# Altium schematic sheet 0250.SchDoc
size 848 x 558 mm
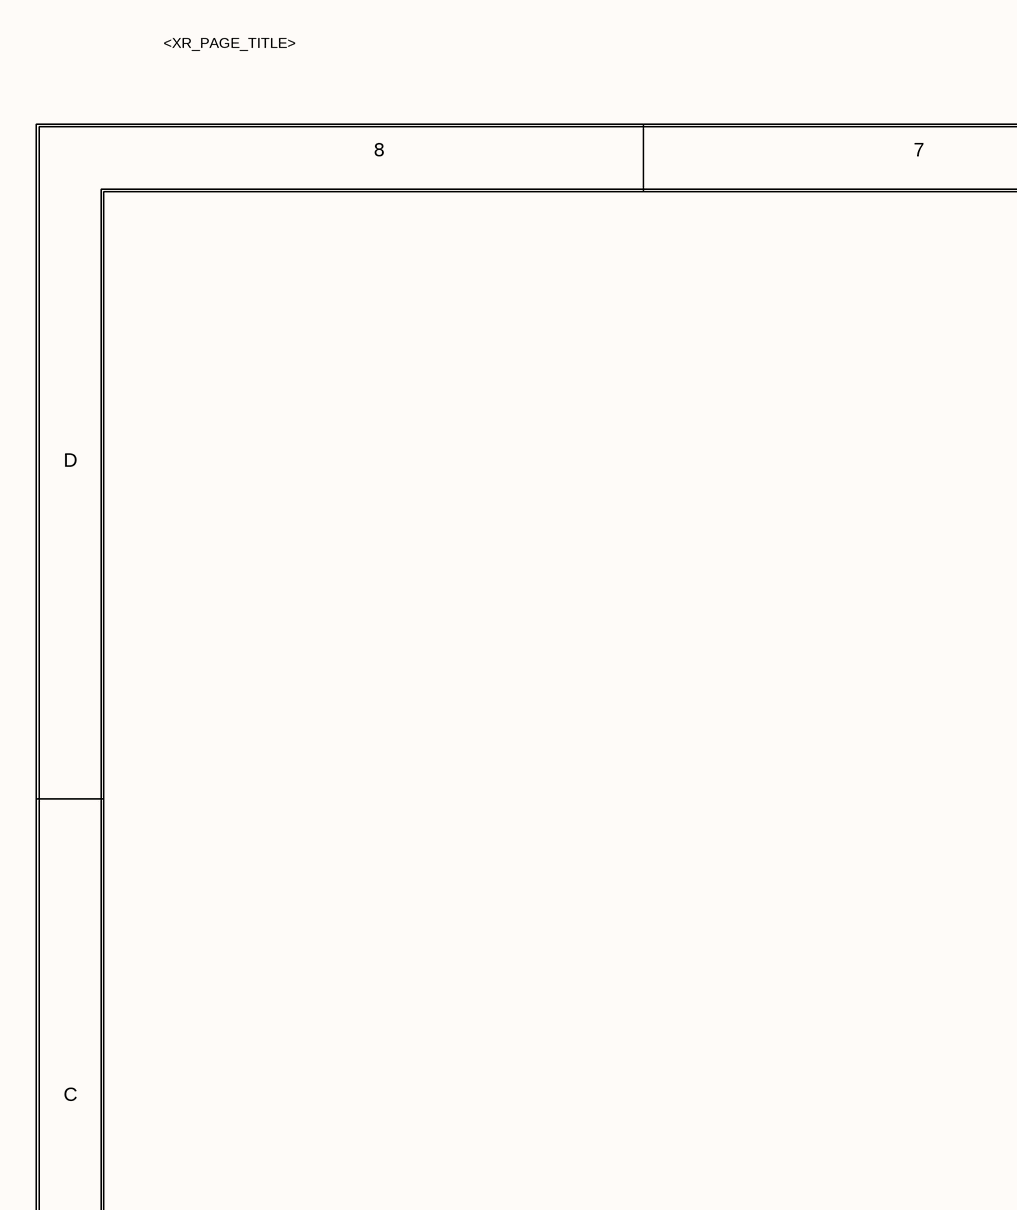
[diagram p0: 0250.SchDoc, top left]
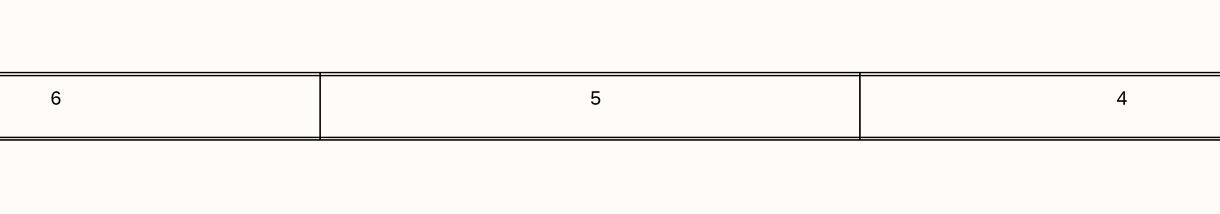
[diagram p1: 0250.SchDoc, top middle]
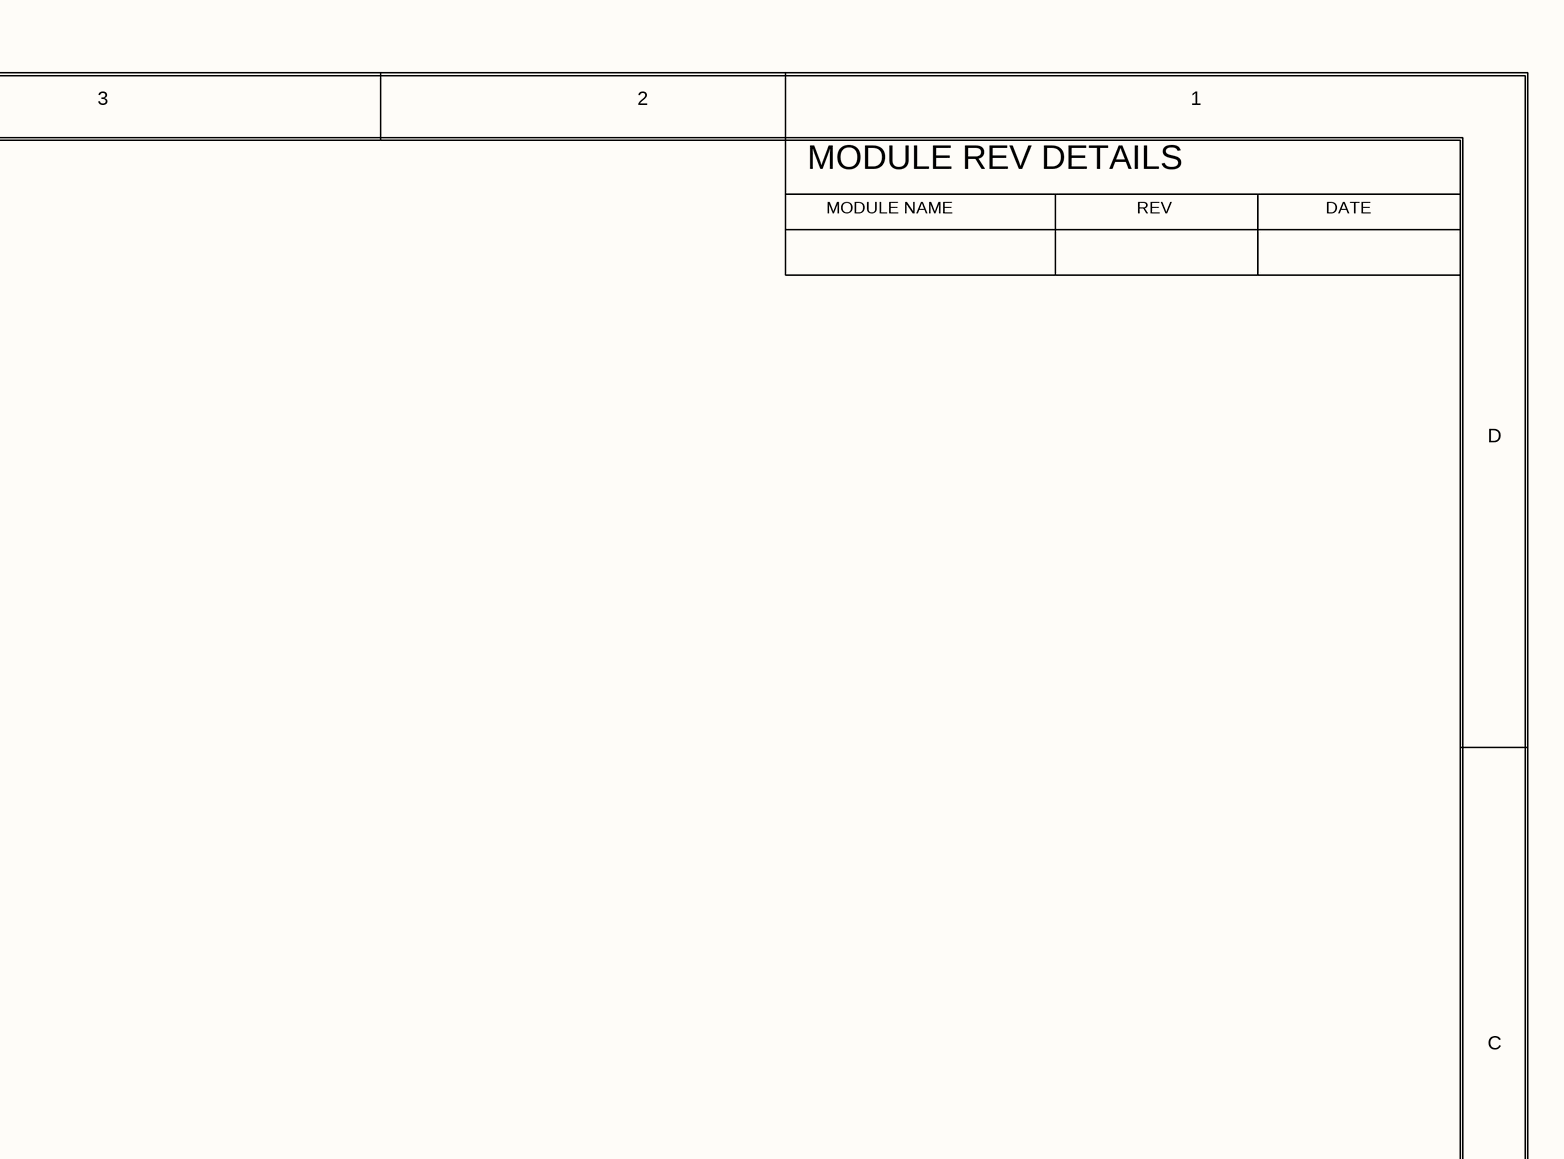
[diagram p2: 0250.SchDoc, top right]
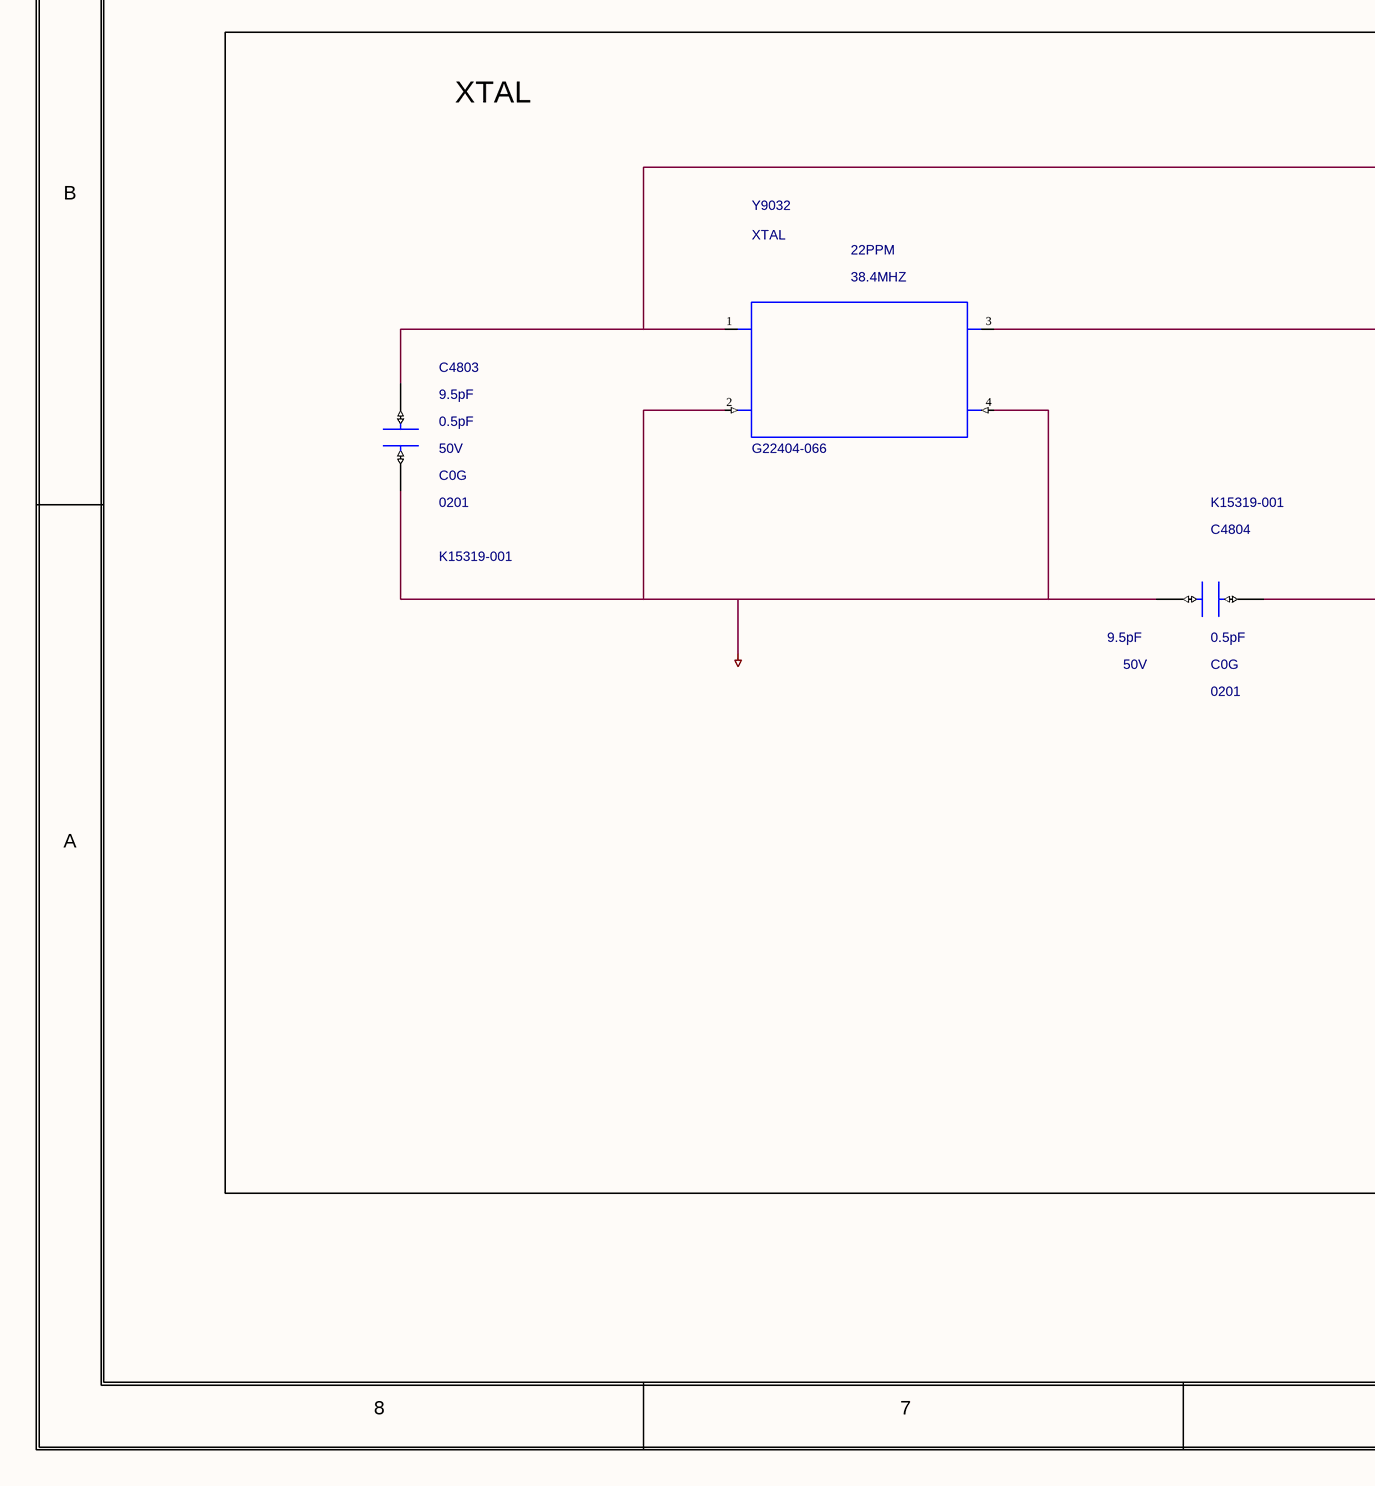
[diagram p3: 0250.SchDoc, bottom left]
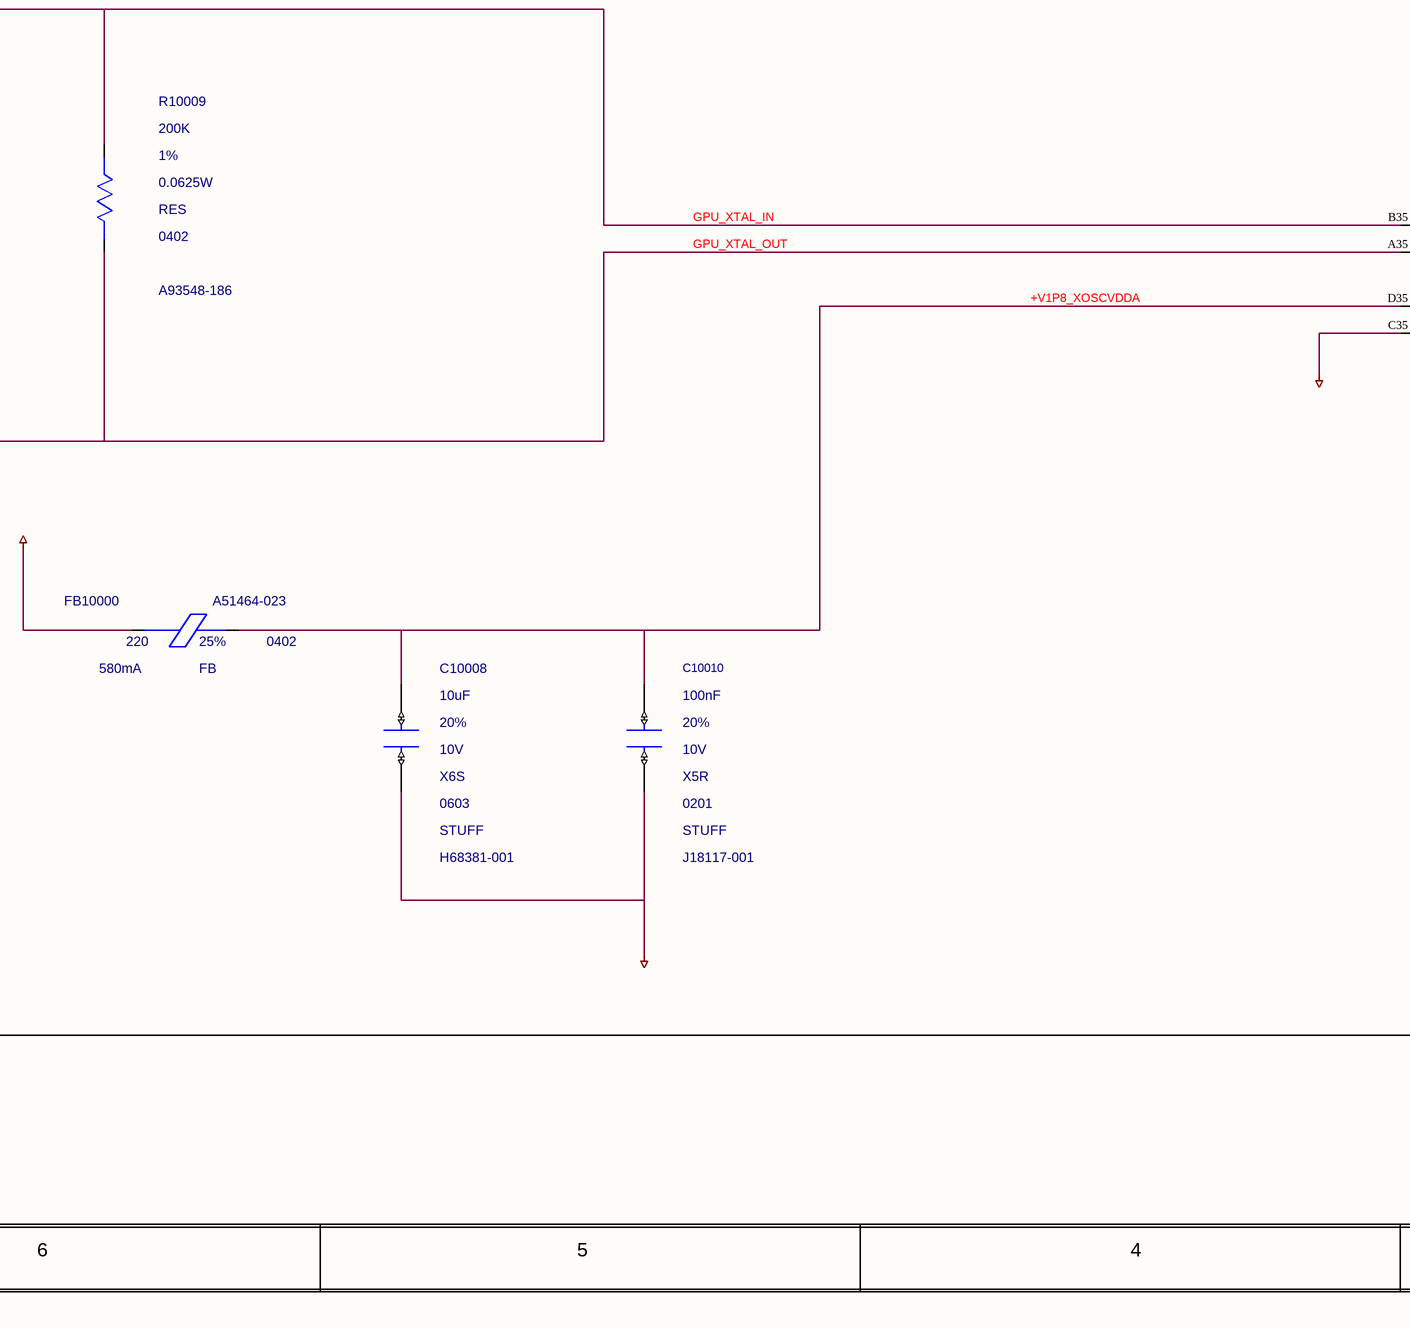
[diagram p4: 0250.SchDoc, bottom middle]
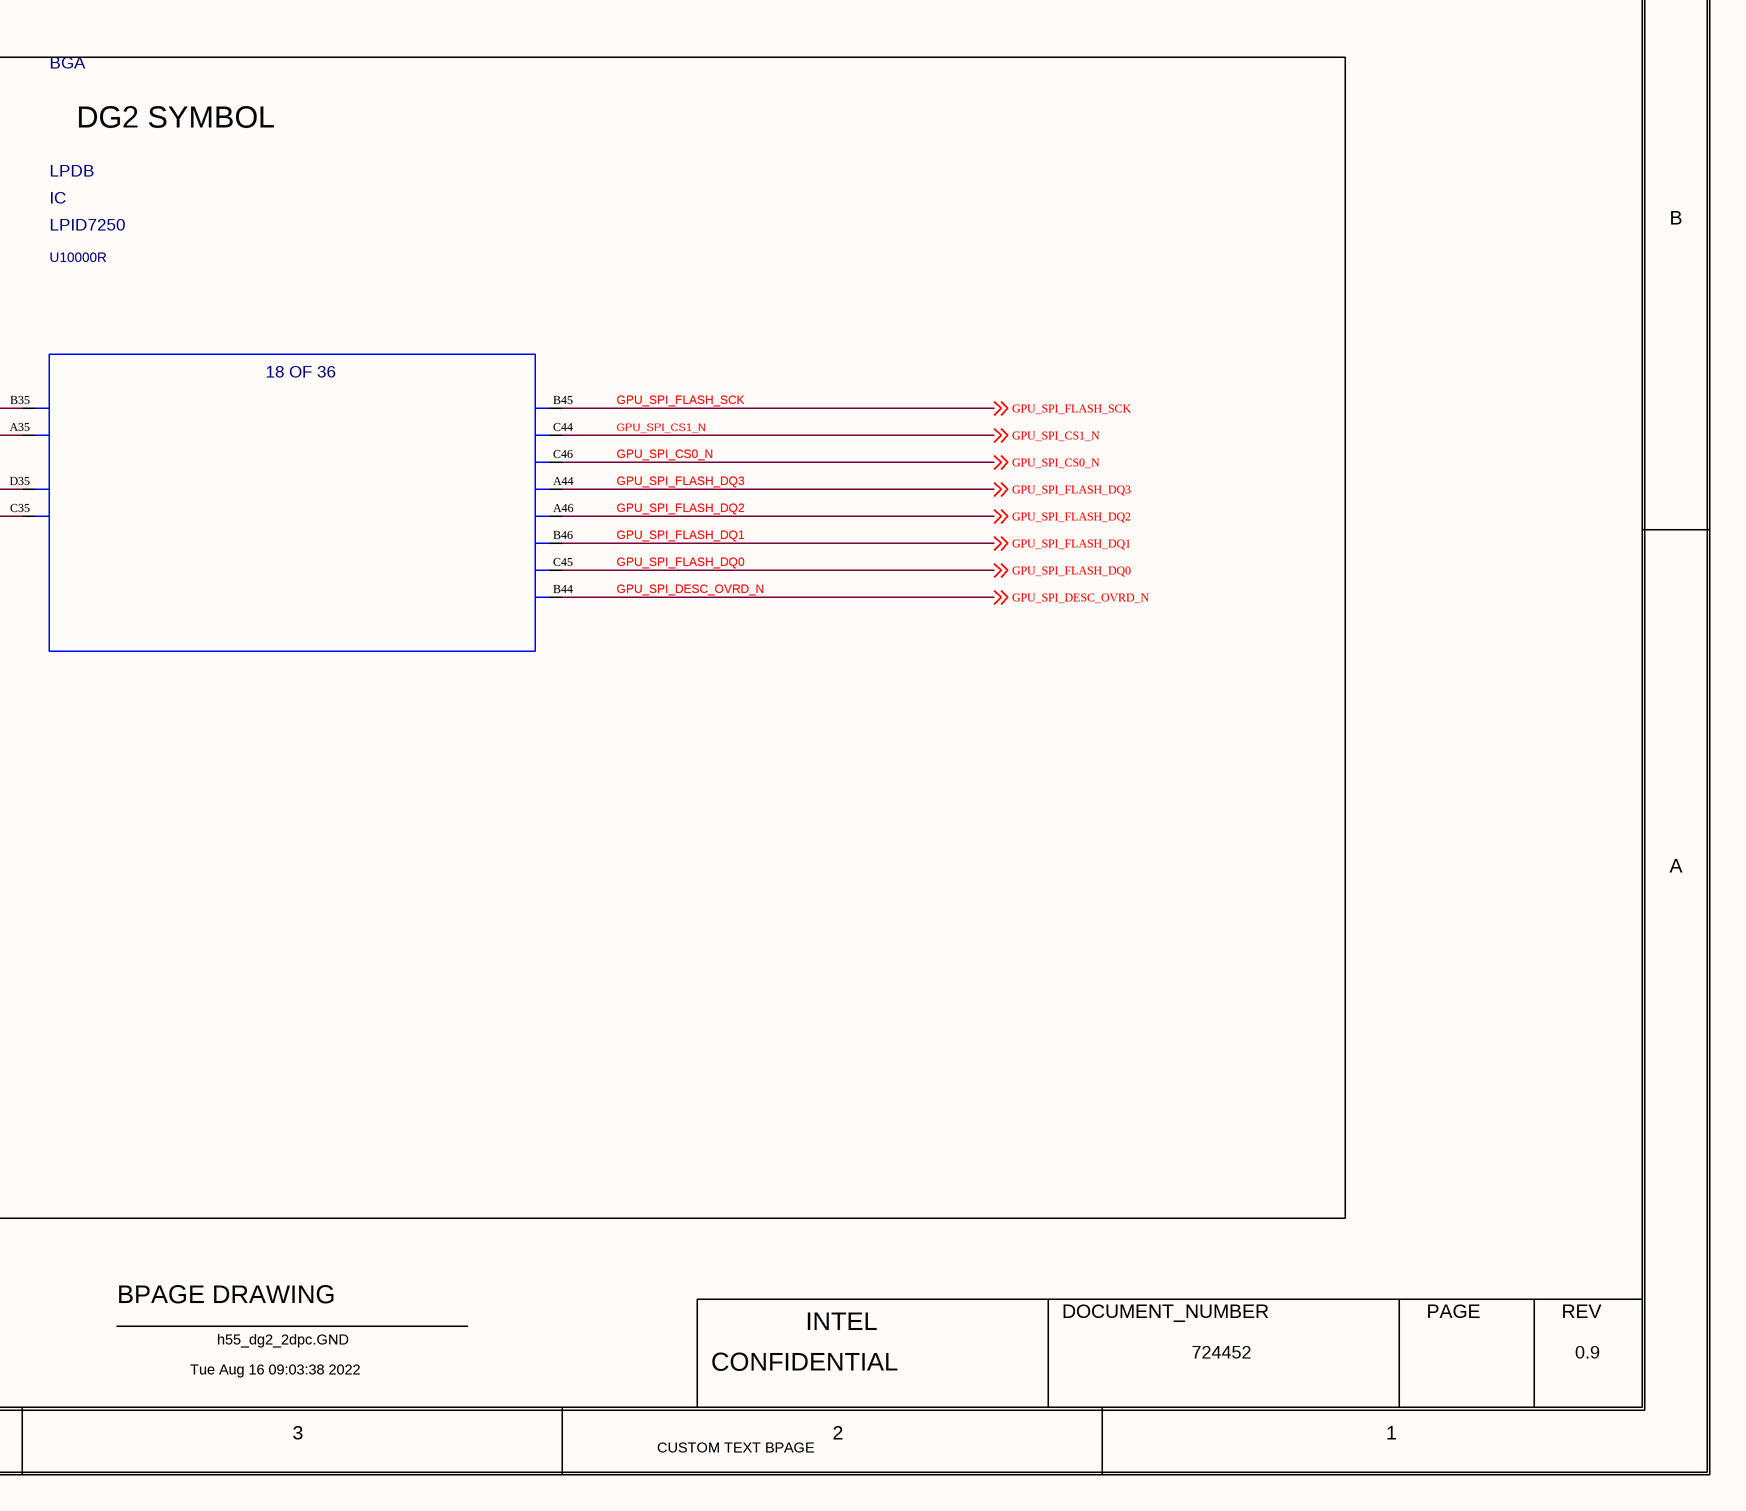
[diagram p5: 0250.SchDoc, bottom right]

## Parts
C4803  9.5pF  MATERIAL: C0G  PACK_TYPE: 0201  PART_NUMBER: K15319-001  TOLERANCE: 0.5pF  VOLTAGE: 50V  [CTK0_SM0201_630X330_MA]
C4804  9.5pF  MATERIAL: C0G  PACK_TYPE: 0201  PART_NUMBER: K15319-001  TOLERANCE: 0.5pF  VOLTAGE: 50V  [CTK0_SM0201_630X330_MA]
C10008  10uF  BOM_USE: STUFF  MATERIAL: X6S  PACK_TYPE: 0603  PART_NUMBER: H68381-001  TOLERANCE: 20%  VOLTAGE: 10V  [TK0_SM0603_1800X1000_MK]
C10010  100nF  BOM_USE: STUFF  MATERIAL: X5R  PACK_TYPE: 0201  PART_NUMBER: J18117-001  TOLERANCE: 20%  VOLTAGE: 10V  [TK0_SM0201_630X330_MC]
FB10000  220  CURRENT: 580mA  MATERIAL: FB  PACK_TYPE: 0402  PART_NUMBER: A51464-023  TOLERANCE: 25%  [TK0_SM0402_1050X550_MB]
R10009  200K  MATERIAL: RES  PACK_TYPE: 0402  PART_NUMBER: A93548-186  TOLERANCE: 1%  WATTAGE: 0.0625W  [CTK0_SM0402_1050X550_MA]
U10000  PART_NUMBER: LPID7250  PACK_TYPE: BGA  MATERIAL: IC  FP_TECH: LPDB  [CLPDB_BGA2660_DG2_SVC_512_LP7250_MA]  (hidden comment: DG2_IP_NB_SKU1_SKU2_SKU3_EXT)  (part R of 36)
Y9032  38.4MHZ  MATERIAL: XTAL  PART_NUMBER: G22404-066  TOLERANCE: 22PPM  [TK0_SMY4_1700X2100_MA]

## Nets
+V1P8S_GPU: FB10000.1(A)
GND: C4803.2(B) C4804.1(A) C10008.2(B) C10010.2(B) U10000.C35(VSSXOSCVSSA) Y9032.2(GND1) Y9032.4(GND2)
+V1P8_XOSCVDDA: C10008.1(A) C10010.1(A) FB10000.2(B) U10000.D35(VCCXOSCVDDA)
GPU_SPI_CS0_N: U10000.C46(SPI_CS0#) ; off-sheet GPU_SPI_CS0_N
GPU_SPI_CS1_N: U10000.C44(SPI_CS1#) ; off-sheet GPU_SPI_CS1_N
GPU_SPI_DESC_OVRD_N: U10000.B44(SPI_DESC_OVRD#) ; off-sheet GPU_SPI_DESC_OVRD_N
GPU_SPI_FLASH_DQ0: U10000.C45(SPI_DATA_0) ; off-sheet GPU_SPI_FLASH_DQ0
GPU_SPI_FLASH_DQ1: U10000.B46(SPI_DATA_1) ; off-sheet GPU_SPI_FLASH_DQ1
GPU_SPI_FLASH_DQ2: U10000.A46(SPI_DATA_2) ; off-sheet GPU_SPI_FLASH_DQ2
GPU_SPI_FLASH_DQ3: U10000.A44(SPI_DATA_3) ; off-sheet GPU_SPI_FLASH_DQ3
GPU_SPI_FLASH_SCK: U10000.B45(SPI_CLK) ; off-sheet GPU_SPI_FLASH_SCK
GPU_XTAL_IN: C4803.1(A) R10009.1(A) U10000.B35(CRCLK_XTAL_IN) Y9032.1(XTAL1)
GPU_XTAL_OUT: C4804.2(B) R10009.2(B) U10000.A35(CRCLK_XTAL_OUT) Y9032.3(XTAL2)

## Notes on the sheet
- <XR_PAGE_TITLE>
- 8
- 7
- 6
- 5
- 4
- 3
- 2
- 1
- MODULE REV DETAILS
- MODULE NAME
- REV
- DATE
- D
- C
- XTAL
- DG2 SYMBOL
- B
- A
- BPAGE DRAWING
- INTEL
- DOCUMENT_NUMBER
- PAGE
- Tue Aug 16 09:03:38 2022
- h55_dg2_2dpc.GND
- CONFIDENTIAL
- 724452
- 0.9
- CUSTOM TEXT BPAGE
- (in symbol DG2_IP_NB_SKU1_SKU2_SKU3_EXT, part R) 18 OF 36

## Library data of the parts
C4803 = C_CAP: CDS_PHYS_PART_NAME: C_CAP_0201-K15319-001,C0G,9.5PF,50V,0.5PF,TK0,GENERIC; CDS_LMAN_SYM_OUTLINE: -50,50,50,-50; FP_TECH: TK0; IP: GENERIC; ROOM: NONE; OriginalSymbolOrigin: (-50,25); XY: (-14350,1650); VER: 1; ROT: 0; PHYS_PAGE: 250; LOCATION: C4803; DRAWING: @RVP1_ADL_SB_ADP_S_DDR5_SODIMM_2DPC_LIB.H55_DG2_2DPC(SCH_1):PAGE419; CDS_LIB: c_discrete; VARIANT: ?; PCB Footprint: CTK0_SM0201_630X330_MA; CHIPS_PART_NAME: C_CAP; CDS_PART_NAME: C_CAP_0201-K15319-001,C0G,9.5PF,50V,0.5PF,TK0,GENERIC; CDS_LOCATION: C4803
C4804 = C_CAP#1: CHIPS_PART_NAME: C_CAP; CDS_PHYS_PART_NAME: C_CAP_0201-K15319-001,C0G,9.5PF,50V,0.5PF,TK0,GENERIC; CDS_LMAN_SYM_OUTLINE: -50,50,50,-50; FP_TECH: TK0; IP: GENERIC; ROOM: NONE; OriginalSymbolOrigin: (-25,50); XY: (-12850,1350); VER: 2; ROT: 0; PHYS_PAGE: 250; LOCATION: C4804; DRAWING: @RVP1_ADL_SB_ADP_S_DDR5_SODIMM_2DPC_LIB.H55_DG2_2DPC(SCH_1):PAGE419; CDS_LIB: c_discrete; VARIANT: ?; PCB Footprint: CTK0_SM0201_630X330_MA; CDS_PART_NAME: C_CAP_0201-K15319-001,C0G,9.5PF,50V,0.5PF,TK0,GENERIC; CDS_LOCATION: C4804
C10008 = CAP_2: CDS_PHYS_PART_NAME: CAP_2_0603-H68381-001,X6S,10UF,10V,20%,TK0,GENERIC; CDS_LMAN_SYM_OUTLINE: -50,50,50,-50; FP_TECH: TK0; IP: GENERIC; ROOM: NONE; OriginalSymbolOrigin: (-50,25); XY: (-11750,800); VER: 1; ROT: 0; PHYS_PAGE: 250; LOCATION: C10008; DRAWING: @RVP1_ADL_SB_ADP_S_DDR5_SODIMM_2DPC_LIB.H55_DG2_2DPC(SCH_1):PAGE419; CDS_LIB: discrete_2; VARIANT: ?; PCB Footprint: TK0_SM0603_1800X1000_MK; CHIPS_PART_NAME: CAP_2; CDS_PART_NAME: CAP_2_0603-H68381-001,X6S,10UF,10V,20%,TK0,GENERIC; CDS_LOCATION: C10008
C10010 = CAP_2: CDS_PHYS_PART_NAME: CAP_2_0201-J18117-001,X5R,100NF,10V,20%,TK0,GENERIC; CDS_LMAN_SYM_OUTLINE: -50,50,50,-50; FP_TECH: TK0; IP: GENERIC; ROOM: NONE; OriginalSymbolOrigin: (-50,25); XY: (-11300,800); VER: 1; ROT: 0; PHYS_PAGE: 250; LOCATION: C10010; DRAWING: @RVP1_ADL_SB_ADP_S_DDR5_SODIMM_2DPC_LIB.H55_DG2_2DPC(SCH_1):PAGE419; CDS_LIB: discrete_2; VARIANT: ?; PCB Footprint: TK0_SM0201_630X330_MC; CHIPS_PART_NAME: CAP_2; CDS_PART_NAME: CAP_2_0201-J18117-001,X5R,100NF,10V,20%,TK0,GENERIC; CDS_LOCATION: C10010
FB10000 = FERRITE_2: CDS_PHYS_PART_NAME: FERRITE_2_0402-A51464-023,FB,220,25%,580MA,TK0,GENERIC; BOM_USE: STUFF; CDS_LMAN_SYM_OUTLINE: -50,50,50,-50; FP_TECH: TK0; IP: GENERIC; ROOM: NONE; OriginalSymbolOrigin: (-75,50); XY: (-12150,1000); VER: 1; ROT: 0; PHYS_PAGE: 250; LOCATION: FB10000; DRAWING: @RVP1_ADL_SB_ADP_S_DDR5_SODIMM_2DPC_LIB.H55_DG2_2DPC(SCH_1):PAGE419; CDS_LIB: discrete_2; VARIANT: ?; PCB Footprint: TK0_SM0402_1050X550_MB; CHIPS_PART_NAME: FERRITE_2; CDS_PART_NAME: FERRITE_2_0402-A51464-023,FB,220,25%,580MA,TK0,GENERIC; CDS_LOCATION: FB10000
R10009 = C_RES: CDS_PHYS_PART_NAME: C_RES_0402-A93548-186,RES,200K,1%,0.0625W,TK0,GENERIC; CDS_LMAN_SYM_OUTLINE: -50,50,50,-50; FP_TECH: TK0; IP: GENERIC; ROOM: NONE; OriginalSymbolOrigin: (-25,75); XY: (-12300,1800); VER: 2; ROT: 0; PHYS_PAGE: 250; LOCATION: R10009; DRAWING: @RVP1_ADL_SB_ADP_S_DDR5_SODIMM_2DPC_LIB.H55_DG2_2DPC(SCH_1):PAGE419; CDS_LIB: c_discrete; VARIANT: ?; PCB Footprint: CTK0_SM0402_1050X550_MA; CHIPS_PART_NAME: C_RES; CDS_PART_NAME: C_RES_0402-A93548-186,RES,200K,1%,0.0625W,TK0,GENERIC; CDS_LOCATION: R10009
U10000 = DG2_IP_NB_SKU1_SKU2_SKU3_EXT: MANUF: INTEL CORP; CDS_PHYS_PART_NAME: DG2_IP_NB_SKU1_SKU2_SKU3_EXT_BGA-LPID7250,IC,DG2_IP_NB_SKU1_SKUA; CDS_LMAN_SYM_OUTLINE: -300,850,300,-800; OriginalSymbolOrigin: (-325,850); CaptureCellPackProp: DG2_IP_NB_SKU1_SKU2_SKU3_EXTR; XY: (-9400,1550); VER: 18; ROT: 0; PHYS_PAGE: 250; MFG_PN: NONE; LOCATION: U10000; DRAWING: @RVP1_ADL_SB_ADP_S_DDR5_SODIMM_2DPC_LIB.H55_DG2_2DPC(SCH_1):PAGE419; CDS_LIB: rvp1_adl_sb_adp_s_ddr5_sodimm_2dpc_lib; BMAP_REV: 1.0; PCB Footprint: CLPDB_BGA2660_DG2_SVC_512_LP7250_MA; SEC_TYPE: BGA; CHIPS_PART_NAME: DG2_IP_NB_SKU1_SKU2_SKU3_EXT; CDS_PART_NAME: DG2_IP_NB_SKU1_SKU2_SKU3_EXT_BGA-LPID7250,IC,DG2_IP_NB_SKU1_SKUA; CDS_LOCATION: U10000
Y9032 = XTAL_4P_2: CDS_PHYS_PART_NAME: XTAL_4P_2_SMB-G22404-066,XTAL,38.4MHZ,22PPM,TK0,GENERIC; BOM_USE: STUFF; CDS_LMAN_SYM_OUTLINE: -200,100,200,-150; FP_TECH: TK0; IP: GENERIC; PACK_TYPE: SMB; ROOM: NONE; OriginalSymbolOrigin: (-225,100); XY: (-13500,1800); VER: 3; ROT: 0; PHYS_PAGE: 250; LOCATION: Y9032; DRAWING: @RVP1_ADL_SB_ADP_S_DDR5_SODIMM_2DPC_LIB.H55_DG2_2DPC(SCH_1):PAGE419; CDS_LIB: discrete_2; VARIANT: ?; PCB Footprint: TK0_SMY4_1700X2100_MA; SEC_TYPE: SMB; CHIPS_PART_NAME: XTAL_4P_2; CDS_PART_NAME: XTAL_4P_2_SMB-G22404-066,XTAL,38.4MHZ,22PPM,TK0,GENERIC; CDS_LOCATION: Y9032